# EAGLE design windowV2 (EAGLE 9.6.2)
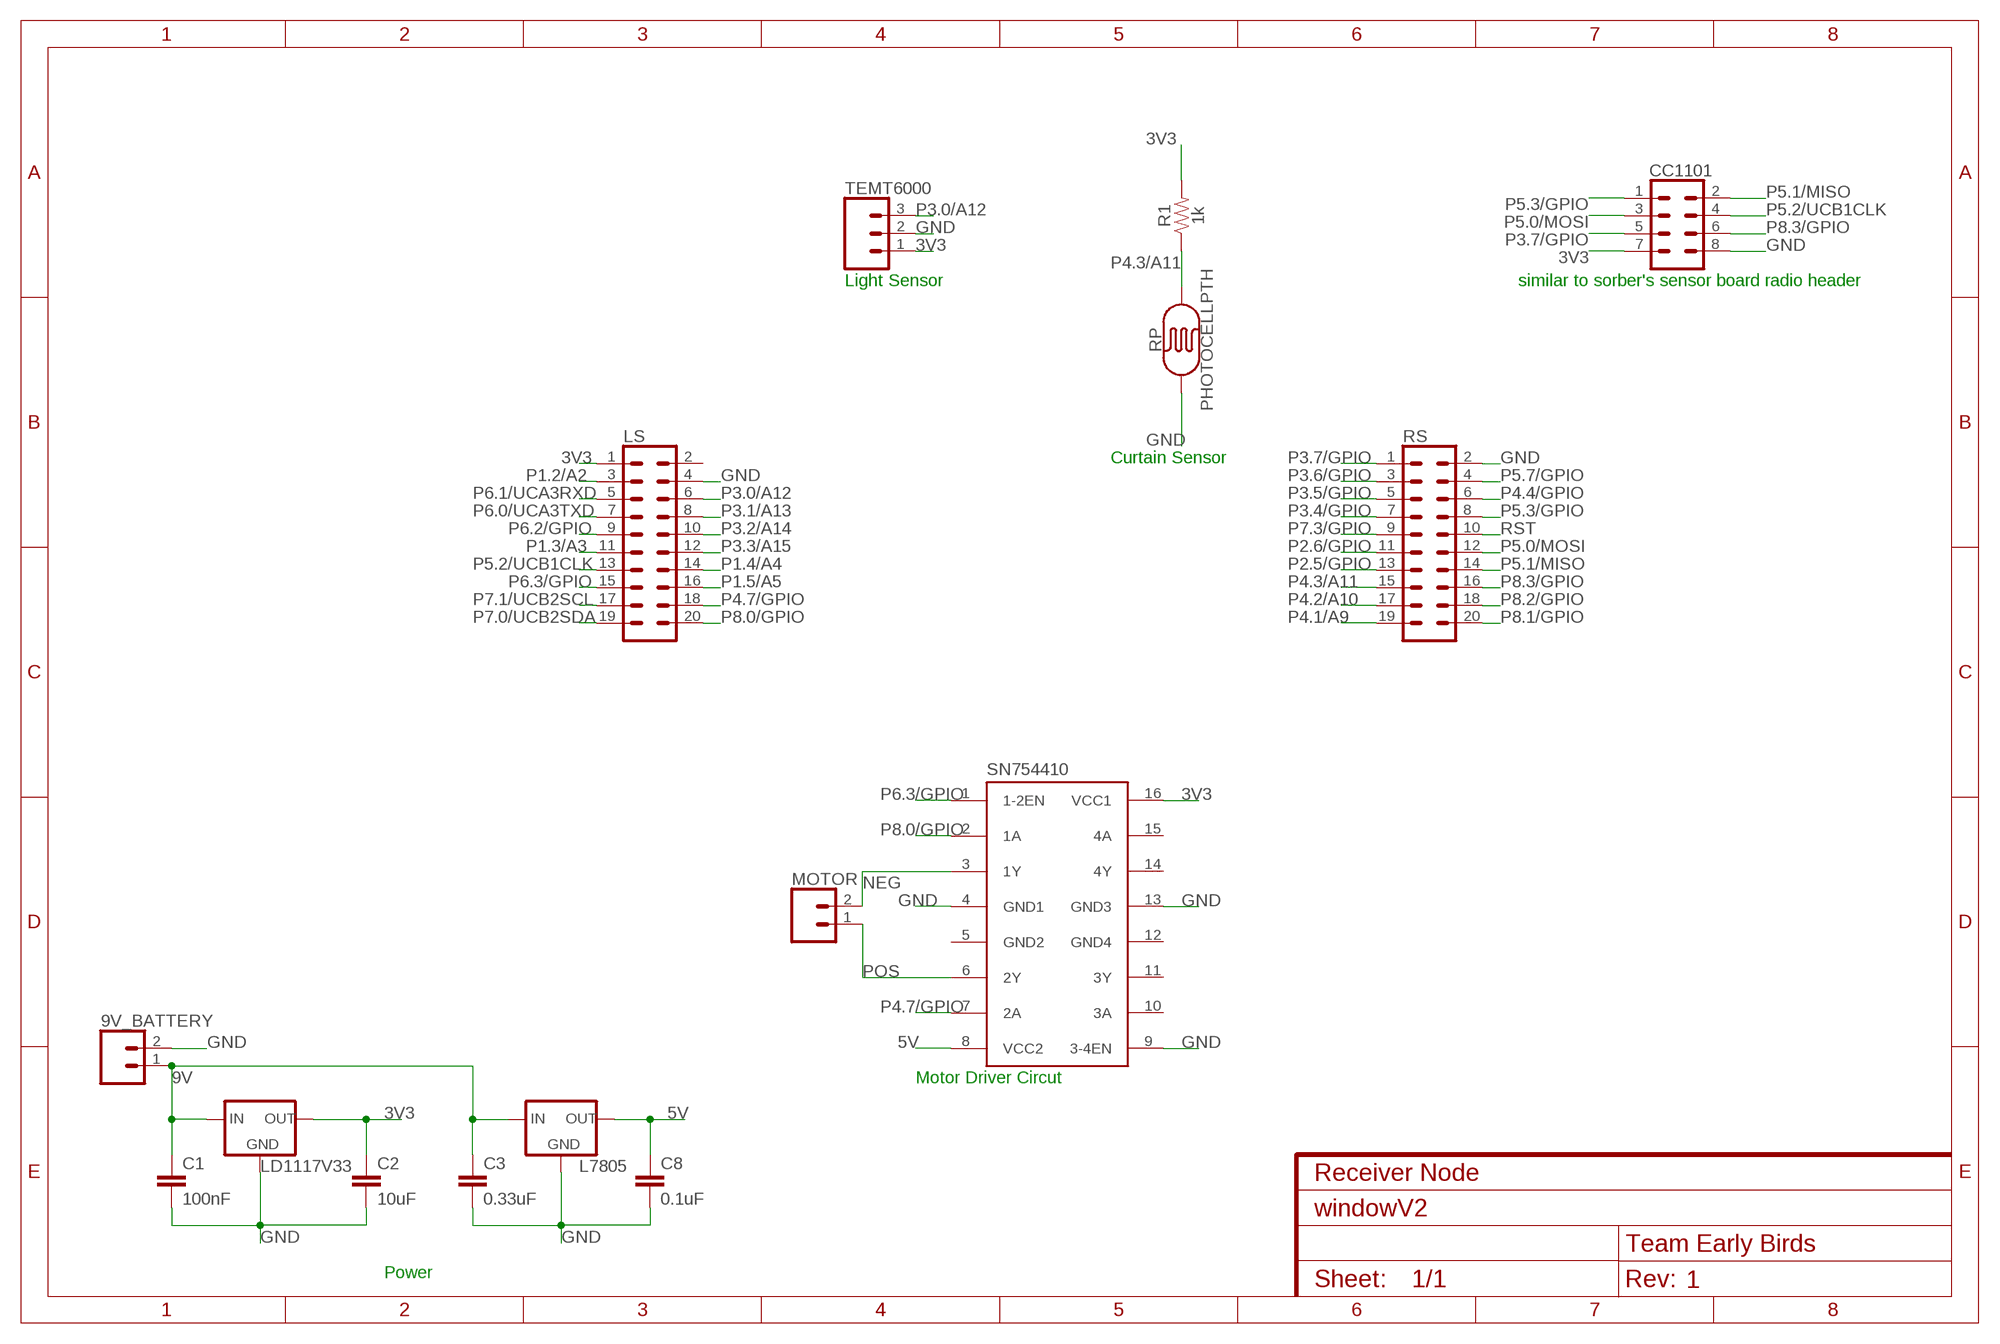
[diagram p0: schematic, sheet 1]
FRAME2 (FRAME-A4L): CNAME: Receiver Node; CREVISION: 1; DESIGNER: Team Early Birds; REV: 1

## Parts
9V_BATTERY  CONN_02  [1X02]
C1  100nF  C2.5/2  [C2.5-2]
C2  10uF  C2.5/2  [C2.5-2]
C3  0.33uF  C2.5/2  [C2.5-2]
C8  0.1uF  C2.5/2  [C2.5-2]
CC1101  CONN_04X2  [2X4]
L7805  V_REG_78XX-TO-220  [TO-220-ALT]
LD1117V33  V_REG_LD1117VXX  [TO-220-ALT2]
LS  CONN_10X2  [2X10]
MOTOR  CONN_02  [1X02]
R1  1k  1KOHM-HORIZ-1/4W-1%  [AXIAL-0.3]
RP  PHOTOCELLPTH  [PHOTOCELL]
RS  CONN_10X2  [2X10]
SN754410  L293D  [DIL16]
TEMT6000  455-1750-1-ND  CONN_03  [1X03]

## Nets
3V3: C2.1 CC1101.7 LD1117V33.OUT LS.1 R1.P$2 SN754410.16(VCC1) TEMT6000.1
5V: C8.1 L7805.OUT SN754410.8(VCC2)
9V: 9V_BATTERY.1 C1.1 C3.1 L7805.IN LD1117V33.IN
GND: 9V_BATTERY.2 C1.2 C2.2 C3.2 C8.2 CC1101.8 L7805.GND LD1117V33.GND LS.4 RP.1 RS.2 SN754410.4(GND1) SN754410.9(3-4EN) SN754410.13(GND3) TEMT6000.2
NEG: MOTOR.2 SN754410.3(1Y)
P1.2/A2: LS.3
P1.3/A3: LS.11
P1.4/A4: LS.14
P1.5/A5: LS.16
P2.5/GPIO: RS.13
P2.6/GPIO: RS.11
P3.0/A12: LS.6 TEMT6000.3
P3.1/A13: LS.8
P3.2/A14: LS.10
P3.3/A15: LS.12
P3.4/GPIO: RS.7
P3.5/GPIO: RS.5
P3.6/GPIO: RS.3
P3.7/GPIO: CC1101.5 RS.1
P4.1/A9: RS.19
P4.2/A10: RS.17
P4.3/A11: R1.P$1 RP.2 RS.15
P4.4/GPIO: RS.6
P4.7/GPIO: LS.18 SN754410.7(2A)
P5.0/MOSI: CC1101.3 RS.12
P5.1/MISO: CC1101.2 RS.14
P5.2/UCB1CLK: CC1101.4 LS.13
P5.3/GPIO: CC1101.1 RS.8
P5.7/GPIO: RS.4
P6.0/UCA3TXD: LS.7
P6.1/UCA3RXD: LS.5
P6.2/GPIO: LS.9
P6.3/GPIO: LS.15 SN754410.1(1-2EN)
P7.0/UCB2SDA: LS.19
P7.1/UCB2SCL: LS.17
P7.3/GPIO: RS.9
P8.0/GPIO: LS.20 SN754410.2(1A)
P8.1/GPIO: RS.20
P8.2/GPIO: RS.18
P8.3/GPIO: CC1101.6 RS.16
POS: MOTOR.1 SN754410.6(2Y)
RST: RS.10
Unconnected: LS.2 SN754410.10(3A) SN754410.11(3Y) SN754410.14(4Y) SN754410.15(4A)

## Notes on the sheet
- Light Sensor | similar to sorber's sensor board radio header
- Curtain Sensor
- Motor Driver Circut
- Power

## Power pins joined to a net without a drawn wire
GND2: SN754410.5(GND2)
GND4: SN754410.12(GND4)

## Library data of the parts
9V_BATTERY MOTOR = SparkFun-Connectors:CONN_02: Multi connection point. Often used as Generic Header-pin footprint for 0.1 inch spaced/style header connections On any of the 0.1 inch spaced packages, you can populate with these: Break Away Headers - Straight <https://www.sparkfun.com/products/116> (PRT-00116) Break Away Male Headers - Right Angle <https://www.sparkfun.com/products/553> (PRT-00553) Female Headers <https://www.sparkfun.com/products/115> (PRT-00115) Break Away Headers - Machine Pin <https://www.sparkfun.com/products/117> (PRT-00117) Break Away Female Headers - Swiss Machine Pin <https://www.sparkfun.com/products/743> (PRT-00743) For SCREWTERMINALS and SPRING TERMINALS visit here: Screw Terimnals on SparkFun.com <https://www.sparkfun.com/search/results?term=Screw+Terminals> (5mm/3.5mm/2.54mm spacing) This device is also useful as a general connection point to wire up your design to another part of your project. Our various solder wires solder well into these plated through hole pads. Hook-Up Wire - Assortment (Stranded, 22 AWG) <https://www.sparkfun.com/products/11375> (PRT-11375) Hook-Up Wire - Assortment (Solid Core, 22 AWG) <https://www.sparkfun.com/products/11367> (PRT-11367) View the entire wire category on our website here <https://www.sparkfun.com/categories/141> Special notes: Molex polarized connector foot print use with: PRT-08233 with associated crimp pins and housings. 2.54_SCREWTERM for use with PRT-10571. 3.5mm Screw Terminal footprints for PRT-08084 5mm Screw Terminal footprints for use with PRT-08432
C1-C3 C8 = capacitor-wima:C: CAPACITOR naming: grid - package width
CC1101 = SparkFun-Connectors:CONN_04X2: Multi connection point. Often used as Generic Header-pin footprint for 0.1 inch spaced/style header connections On any of the 0.1 inch spaced packages, you can populate with these: Break Away Headers - Straight <https://www.sparkfun.com/products/116> (PRT-00116) Break Away Male Headers - Right Angle <https://www.sparkfun.com/products/553> (PRT-00553) Female Headers <https://www.sparkfun.com/products/115> (PRT-00115) Break Away Headers - Machine Pin <https://www.sparkfun.com/products/117> (PRT-00117) Break Away Female Headers - Swiss Machine Pin <https://www.sparkfun.com/products/743> (PRT-00743)
L7805 = SparkFun-IC-Power:V_REG_78XX: Voltage Regulator Standard 78xx regulator. IGO (Input Ground Output). Spark Fun Electronics SKU : COM-00107; PROD_ID: VREG-08450; SF_ID: COM-00107
LD1117V33 = SparkFun-IC-Power:V_REG_LD1117VXX: LD1117VXX voltage regulator. We carry the 3.3V version (COM-00526) in TO-220 package.
LS RS = SparkFun-Connectors:CONN_10X2: Multi connection point. Often used as Generic Header-pin footprint for 0.1 inch spaced/style header connections On any of the 0.1 inch spaced packages, you can populate with these: Break Away Headers - Straight <https://www.sparkfun.com/products/116> (PRT-00116) Break Away Male Headers - Right Angle <https://www.sparkfun.com/products/553> (PRT-00553) Female Headers <https://www.sparkfun.com/products/115> (PRT-00115) Break Away Headers - Machine Pin <https://www.sparkfun.com/products/117> (PRT-00117) Break Away Female Headers - Swiss Machine Pin <https://www.sparkfun.com/products/743> (PRT-00743) Special note about the "SPECIAL" package: This was SPECIALLY designed to be used with our Graphic LCD Backpack. Be sure you want to use this! It is not only staggered on each line of header holes, but IT IS ALSO offset of the center point of the top and bottom lines by 5 mil. This causes the headers to lock into place on the "standard" footprint on the LCD screen. The extra squares on the tdocu layer are there simply to reference other pins (if you were to actually populate a longer header than ten long - this is what we do with the backpacks).
R1 = SparkFun-Resistors:1KOHM: 1kΩ resistor A resistor is a passive two-terminal electrical component that implements electrical resistance as a circuit element. Resistors act to reduce current flow, and, at the same time, act to lower voltage levels within circuits. - Wikipedia; PROD_ID: RES-12182
RP = SparkFun-Sensors:PHOTOCELL: Photocell (Photodetector, Photo Resistor, CdS) This is a very small light sensor. A photocell changes (also called a photodetector, photo resistor, CdS or photoconductive cell) resistance depending on the amount of light it is exposed to. These little sensors make great ambient light triggers (when light in the room turns on, do something). Datasheet <http://cdn.sparkfun.com/datasheets/Sensors/LightImaging/SEN-09088.pdf> SparkFun Products Mini Photocell <https://www.sparkfun.com/products/9088> (SEN-09088); PROD_ID: COMP-09129; SF_ID: SEN-09088
SN754410 = st-microelectronics:L293D: PUSH-PULL 4 CHANNEL DRIVER; MPN: L293D; OC_FARNELL: 9589619; OC_NEWARK: 56P8249
TEMT6000 = SparkFun-Connectors:CONN_03: Multi connection point. Often used as Generic Header-pin footprint for 0.1 inch spaced/style header connections On any of the 0.1 inch spaced packages, you can populate with these: Break Away Headers - Straight <https://www.sparkfun.com/products/116> (PRT-00116) Break Away Male Headers - Right Angle <https://www.sparkfun.com/products/553> (PRT-00553) Female Headers <https://www.sparkfun.com/products/115> (PRT-00115) Break Away Headers - Machine Pin <https://www.sparkfun.com/products/117> (PRT-00117) Break Away Female Headers - Swiss Machine Pin <https://www.sparkfun.com/products/743> (PRT-00743) Stackable Header - 3 Pin (Female, 0.1") <https://www.sparkfun.com/products/13875> (PRT-13875) For SCREWTERMINALS and SPRING TERMINALS visit here: Screw Terimnals on SparkFun.com <https://www.sparkfun.com/search/results?term=Screw+Terminals> (5mm/3.5mm/2.54mm spacing) This device is also useful as a general connection point to wire up your design to another part of your project. Our various solder wires solder well into these plated through hole pads. Hook-Up Wire - Assortment (Stranded, 22 AWG) <https://www.sparkfun.com/products/11375> (PRT-11375) Hook-Up Wire - Assortment (Solid Core, 22 AWG) <https://www.sparkfun.com/products/11367> (PRT-11367) View the entire wire category on our website here <https://www.sparkfun.com/categories/141> Special notes: Molex polarized connector foot print use with SKU : PRT-08232 with associated crimp pins and housings.; PROD_ID: XXX-00000

## Board
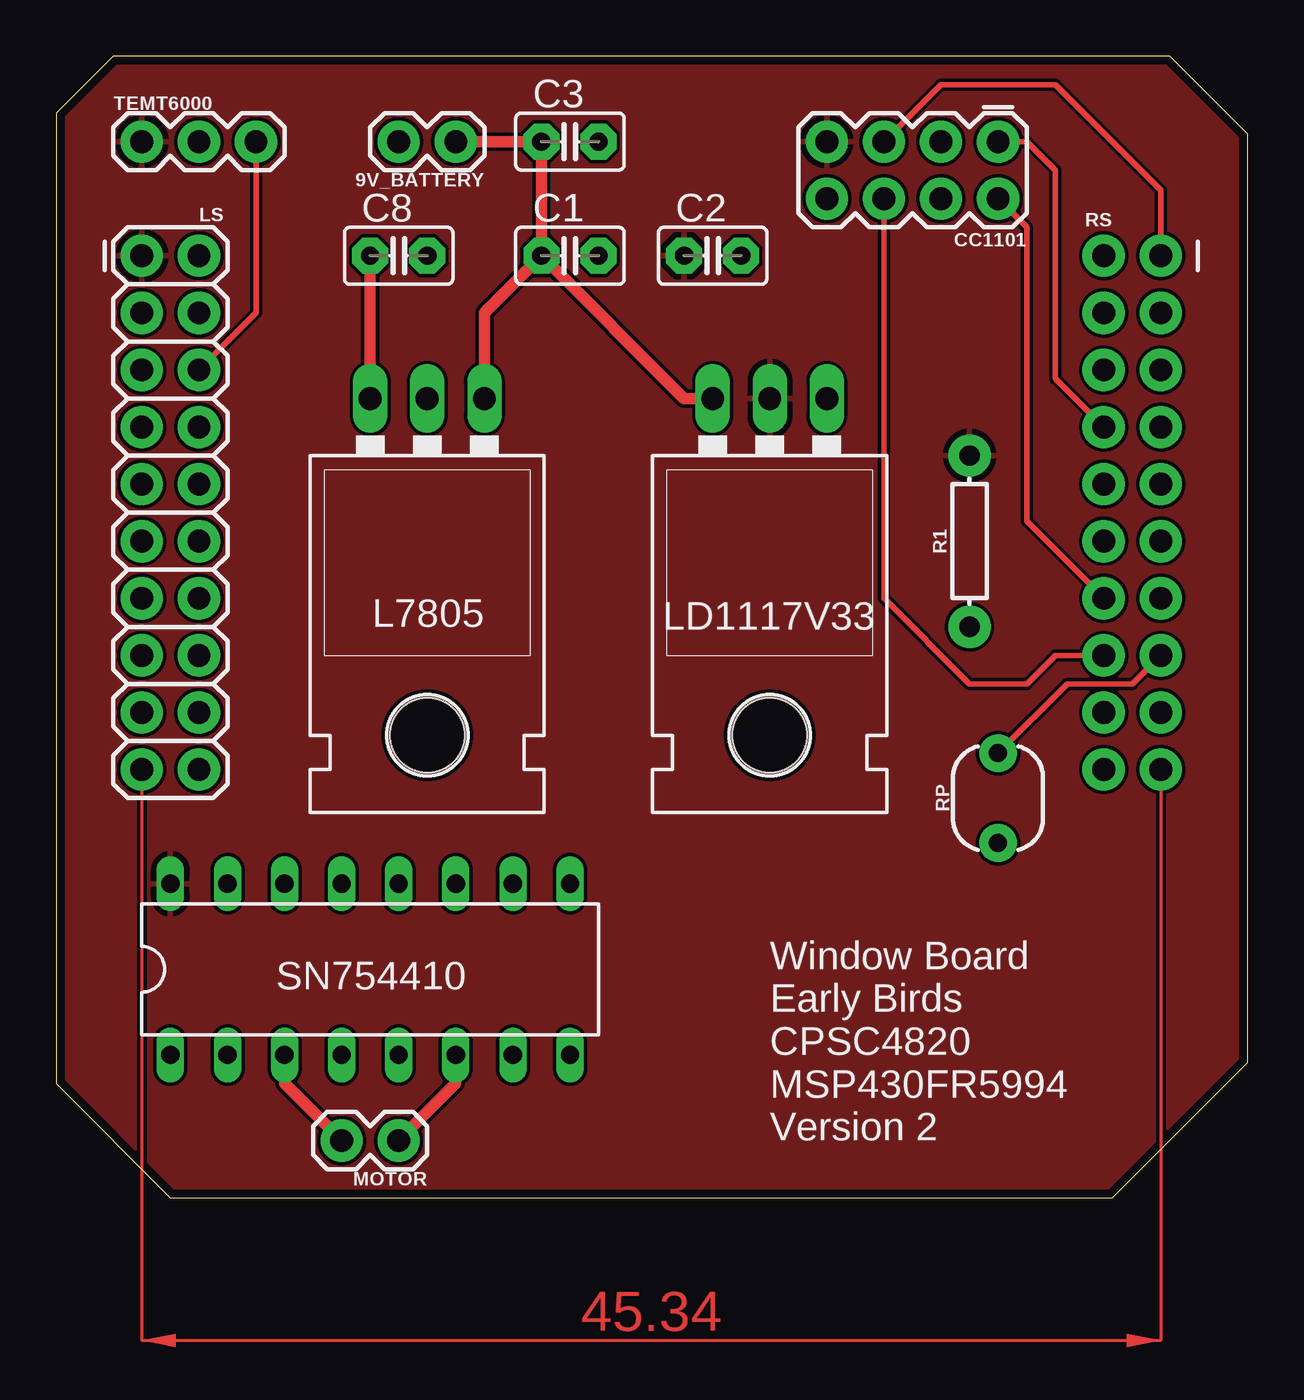
[diagram p1: board, top side]
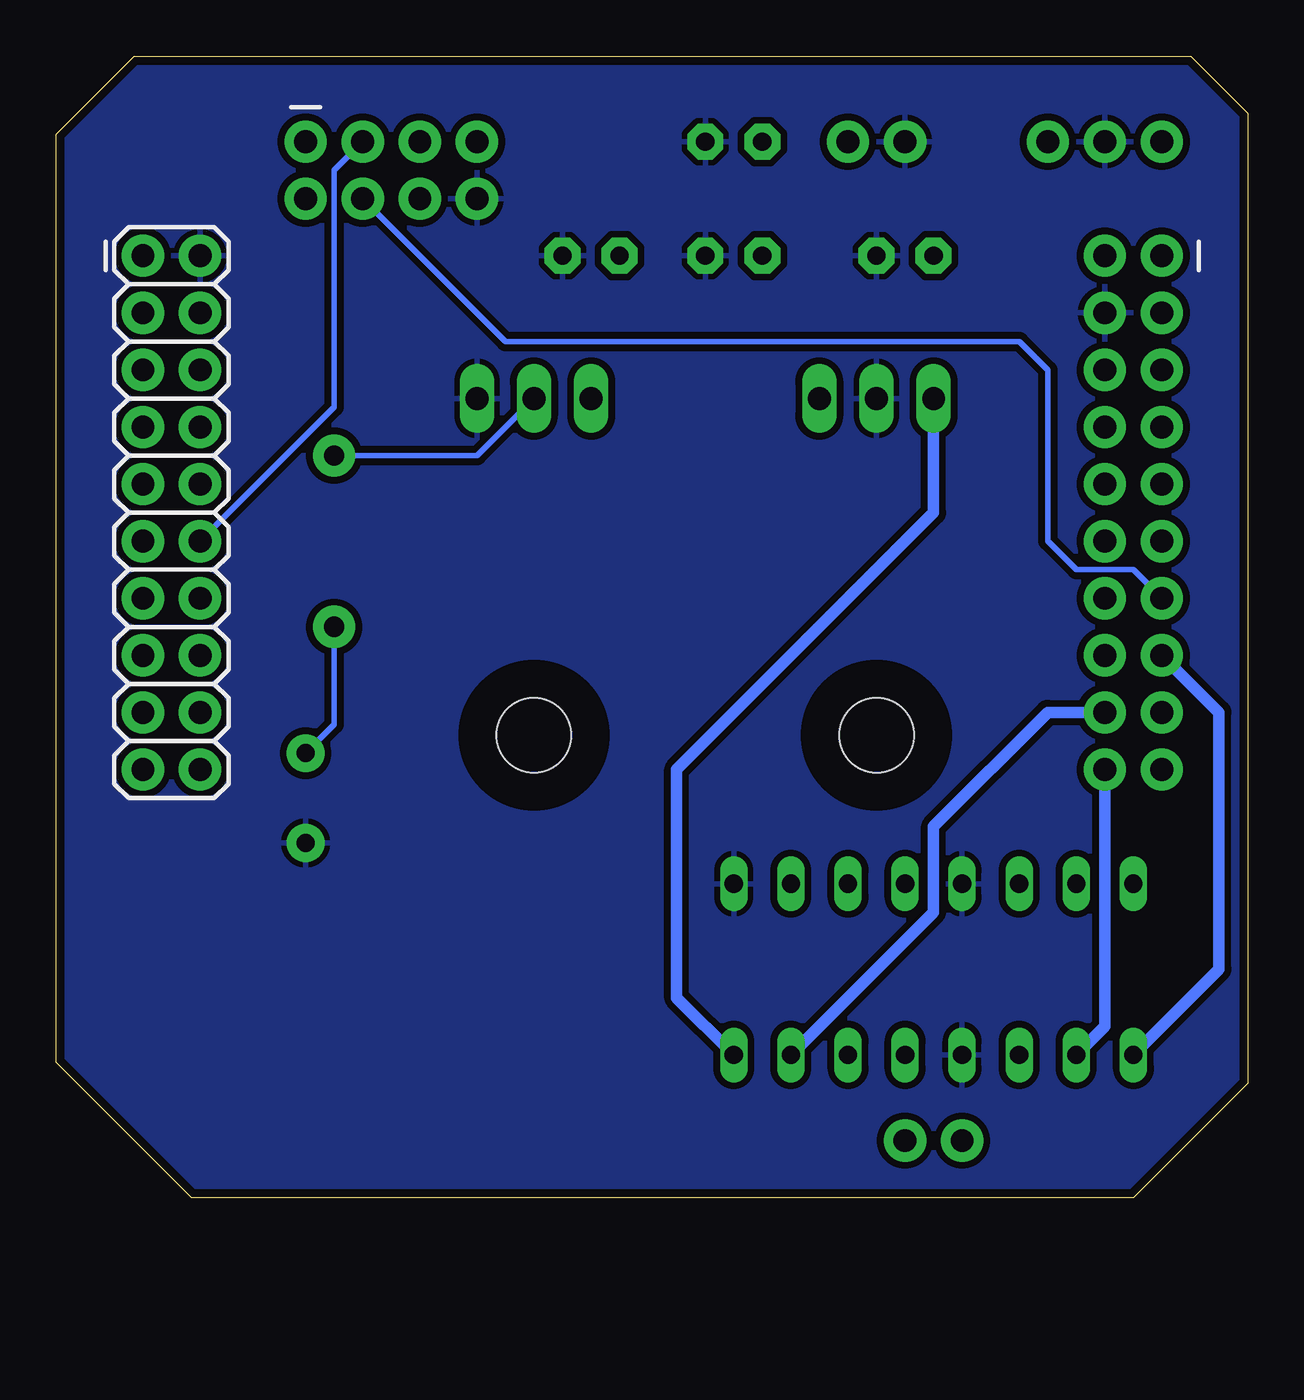
[diagram p2: board, bottom side, seen from below]

Size 53.01 x 50.79 mm. Coordinates in mm from the lower left corner, seen from the top.
Outline: 0,48.26 0,5.08 5.08,0 46.99,0 53.01,6.02 53.01,47.32 49.54,50.79 2.53,50.79 0,48.26
Copper layers (1*16): Top 0.035559375mm / dielectric 1.6mm / Bottom 0.035559375mm
Design rules "oshpark-2layer": minimum track width 6mil, minimum drill 10mil, track to track 6mil, track to pad 6mil, pad to pad 6mil, via to via 6mil, smd to smd 6mil, copper to edge 15mil, drill to drill 6mil, minimum pad ring 5mil, minimum via ring 5mil, stop-mask expansion 2.5mil, vias tented up to drill 0mil, thermal gap 10mil

### Footprints (pad centres in the part's own frame; a part is rotated, then mirrored left to right if it is on the bottom)
1X02 = drill 1.016 pad 1.88: 1 0,0; 2 2.54,0
C2.5-2 = drill 0.813 pad 1.6 octagon: 1 -1.27,0; 2 1.27,0
2X4 = drill 1.016 pad 1.88: 1 -3.81,-1.27; 2 -3.81,1.27; 3 -1.27,-1.27; 4 -1.27,1.27; 5 1.27,-1.27; 6 1.27,1.27; 7 3.81,-1.27; 8 3.81,1.27
TO-220-ALT = drill 1.016 long: GND 0,-3.81; IN -2.54,-3.81; OUT 2.54,-3.81 | hole 3.302: 0,11.176
TO-220-ALT2 = drill 1.016 long: GND -2.54,-3.81; IN 2.54,-3.81; OUT 0,-3.81 | hole 3.302: 0,11.176
2X10 = drill 1.016 pad 1.88: 1 0,0; 2 0,2.54; 3 2.54,0; 4 2.54,2.54; 5 5.08,0; 6 5.08,2.54; 7 7.62,0; 8 7.62,2.54; 9 10.16,0; 10 10.16,2.54; 11 12.7,0; 12 12.7,2.54; 13 15.24,0; 14 15.24,2.54; 15 17.78,0; 16 17.78,2.54; 17 20.32,0; 18 20.32,2.54; 19 22.86,0; 20 22.86,2.54
AXIAL-0.3 = drill 0.9 pad 1.88: P$1 -3.81,0; P$2 3.81,0
PHOTOCELL = drill 0.8 pad 1.676: 1 -2,0; 2 2,0
DIL16 = drill 0.813 long: 1 -8.89,-3.81; 2 -6.35,-3.81; 3 -3.81,-3.81; 4 -1.27,-3.81; 5 1.27,-3.81; 6 3.81,-3.81; 7 6.35,-3.81; 8 8.89,-3.81; 9 8.89,3.81; 10 6.35,3.81; 11 3.81,3.81; 12 1.27,3.81; 13 -1.27,3.81; 14 -3.81,3.81; 15 -6.35,3.81; 16 -8.89,3.81
1X03 = drill 1.016 pad 1.88: 1 0,0; 2 2.54,0; 3 5.08,0

### Placement (x,y rotation side)
9V_BATTERY  17.78,46.99 180 top
C1  22.86,41.91 0 top
C2  29.21,41.91 0 top
C3  22.86,46.99 0 top
C8  15.24,41.91 0 top
CC1101  38.1,45.72 180 top
L7805  16.51,31.75 180 top
LD1117V33  31.75,31.75 180 top
LS  3.81,41.91 270 top
MOTOR  15.24,2.54 180 top
R1  40.64,29.21 90 top
RP  41.91,17.78 90 top
RS  49.15,41.91 270 bottom
SN754410  13.97,10.16 0 top
TEMT6000  3.81,46.99 0 top

### Tracks (layer width: path | path; a pad name or v marks a point on that pad's centre or on a via)
3V3
  Bottom 0.254: LD1117V33.OUT 34.29,33.02 R1.P$2
  pour Top: -1.27,52.07 -1.27,-1.27 55.88,-1.27 55.88,52.07
5V
  Top 0.508: L7805.OUT C8.1
  Bottom 0.508: L7805.OUT 13.97,30.48 25.4,19.05 25.4,8.89 SN754410.8
9V
  Top 0.508: 9V_BATTERY.1 C3.1 C1.1 | C1.1 19.05,39.37 L7805.IN | C1.1 27.94,35.56 LD1117V33.IN
GND
  pour Bottom (isolate 0.305): -2.54,53.34 -2.54,-2.54 58.42,-2.54 58.42,53.34
NEG
  Top 0.508: MOTOR.2 10.16,5.08 SN754410.3
P3.0/A12
  Top 0.254: TEMT6000.3 8.89,39.37 LS.6
P3.7/GPIO
  Top 0.254: CC1101.5 39.37,49.53 44.45,49.53 49.15,44.83 RS.1
P4.3/A11
  Top 0.254: RS.15 47.88,22.86 44.99,22.86 RP.2
  Bottom 0.254: R1.P$1 40.64,21.05 RP.2
P4.7/GPIO
  Bottom 0.508: SN754410.7 13.97,12.7 13.97,16.51 8.89,21.59 LS.18
P5.0/MOSI
  Bottom 0.254: CC1101.3 40.64,45.72 40.64,35.18 RS.12
P5.1/MISO
  Top 0.254: CC1101.2 43.18,43.18 43.18,30.1 RS.14
P5.2/UCB1CLK
  Bottom 0.254: CC1101.4 33.02,38.1 10.16,38.1 8.89,36.83 8.89,29.21 7.62,27.94 5.08,27.94 LS.13
P5.3/GPIO
  Top 0.254: CC1101.1 43.18,46.99 44.45,45.72 44.45,36.45 RS.8
P6.3/GPIO
  Bottom 0.508: SN754410.1 1.27,10.16 1.27,21.59 LS.15
P8.0/GPIO
  Bottom 0.508: SN754410.2 6.35,7.62 LS.20
P8.3/GPIO
  Top 0.254: CC1101.6 36.83,26.67 40.64,22.86 43.18,22.86 44.45,24.13 RS.16
POS
  Top 0.508: MOTOR.1 17.78,5.08 SN754410.6
(copper drawn outside any net)
  shapes: Top area x1

### Text on the board
tPlace: Window Board / Early Birds / CPSC4820 / MSP430FR5994 / Version 2